# EAGLE design LEDPanel (EAGLE 9.4.2)
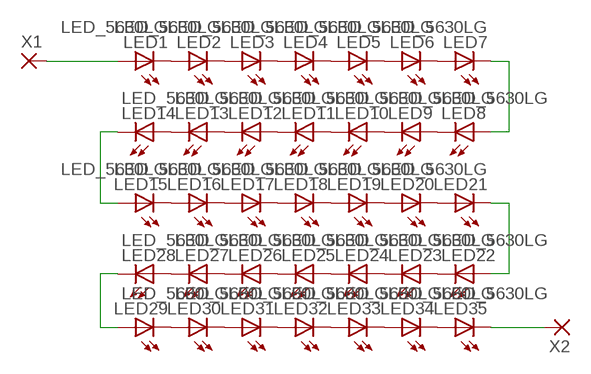
[diagram p0: schematic, sheet 1]

## Parts
LED1  LED_5630LG  [LED5630_LG]
LED2  LED_5630LG  [LED5630_LG]
LED3  LED_5630LG  [LED5630_LG]
LED4  LED_5630LG  [LED5630_LG]
LED5  LED_5630LG  [LED5630_LG]
LED6  LED_5630LG  [LED5630_LG]
LED7  LED_5630LG  [LED5630_LG]
LED8  LED_5630LG  [LED5630_LG]
LED9  LED_5630LG  [LED5630_LG]
LED10  LED_5630LG  [LED5630_LG]
LED11  LED_5630LG  [LED5630_LG]
LED12  LED_5630LG  [LED5630_LG]
LED13  LED_5630LG  [LED5630_LG]
LED14  LED_5630LG  [LED5630_LG]
LED15  LED_5630LG  [LED5630_LG]
LED16  LED_5630LG  [LED5630_LG]
LED17  LED_5630LG  [LED5630_LG]
LED18  LED_5630LG  [LED5630_LG]
LED19  LED_5630LG  [LED5630_LG]
LED20  LED_5630LG  [LED5630_LG]
LED21  LED_5630LG  [LED5630_LG]
LED22  LED_5630LG  [LED5630_LG]
LED23  LED_5630LG  [LED5630_LG]
LED24  LED_5630LG  [LED5630_LG]
LED25  LED_5630LG  [LED5630_LG]
LED26  LED_5630LG  [LED5630_LG]
LED27  LED_5630LG  [LED5630_LG]
LED28  LED_5630LG  [LED5630_LG]
LED29  LED_5630LG  [LED5630_LG]
LED30  LED_5630LG  [LED5630_LG]
LED31  LED_5630LG  [LED5630_LG]
LED32  LED_5630LG  [LED5630_LG]
LED33  LED_5630LG  [LED5630_LG]
LED34  LED_5630LG  [LED5630_LG]
LED35  LED_5630LG  [LED5630_LG]
X1  WIREPAD-SMD2  [PAD-1.27X2.54]
X2  WIREPAD-SMD2  [PAD-1.27X2.54]

## Nets
1: LED1.A1(A) LED1.A2(A) LED1.A-TAB(A) X1.P$1(P)
2: LED1.C1(C) LED1.C-NC(C) LED2.A1(A) LED2.A2(A) LED2.A-TAB(A)
3: LED2.C1(C) LED2.C-NC(C) LED3.A1(A) LED3.A2(A) LED3.A-TAB(A)
4: LED3.C1(C) LED3.C-NC(C) LED4.A1(A) LED4.A2(A) LED4.A-TAB(A)
5: LED4.C1(C) LED4.C-NC(C) LED5.A1(A) LED5.A2(A) LED5.A-TAB(A)
6: LED5.C1(C) LED5.C-NC(C) LED6.A1(A) LED6.A2(A) LED6.A-TAB(A)
7: LED6.C1(C) LED6.C-NC(C) LED7.A1(A) LED7.A2(A) LED7.A-TAB(A)
8: LED7.C1(C) LED7.C-NC(C) LED8.A1(A) LED8.A2(A) LED8.A-TAB(A)
9: LED8.C1(C) LED8.C-NC(C) LED9.A1(A) LED9.A2(A) LED9.A-TAB(A)
10: LED9.C1(C) LED9.C-NC(C) LED10.A1(A) LED10.A2(A) LED10.A-TAB(A)
11: LED10.C1(C) LED10.C-NC(C) LED11.A1(A) LED11.A2(A) LED11.A-TAB(A)
12: LED11.C1(C) LED11.C-NC(C) LED12.A1(A) LED12.A2(A) LED12.A-TAB(A)
13: LED12.C1(C) LED12.C-NC(C) LED13.A1(A) LED13.A2(A) LED13.A-TAB(A)
14: LED13.C1(C) LED13.C-NC(C) LED14.A1(A) LED14.A2(A) LED14.A-TAB(A)
15: LED14.C1(C) LED14.C-NC(C) LED15.A1(A) LED15.A2(A) LED15.A-TAB(A)
16: LED15.C1(C) LED15.C-NC(C) LED16.A1(A) LED16.A2(A) LED16.A-TAB(A)
17: LED16.C1(C) LED16.C-NC(C) LED17.A1(A) LED17.A2(A) LED17.A-TAB(A)
18: LED17.C1(C) LED17.C-NC(C) LED18.A1(A) LED18.A2(A) LED18.A-TAB(A)
19: LED18.C1(C) LED18.C-NC(C) LED19.A1(A) LED19.A2(A) LED19.A-TAB(A)
20: LED19.C1(C) LED19.C-NC(C) LED20.A1(A) LED20.A2(A) LED20.A-TAB(A)
21: LED20.C1(C) LED20.C-NC(C) LED21.A1(A) LED21.A2(A) LED21.A-TAB(A)
22: LED21.C1(C) LED21.C-NC(C) LED22.A1(A) LED22.A2(A) LED22.A-TAB(A)
23: LED22.C1(C) LED22.C-NC(C) LED23.A1(A) LED23.A2(A) LED23.A-TAB(A)
24: LED23.C1(C) LED23.C-NC(C) LED24.A1(A) LED24.A2(A) LED24.A-TAB(A)
25: LED24.C1(C) LED24.C-NC(C) LED25.A1(A) LED25.A2(A) LED25.A-TAB(A)
26: LED25.C1(C) LED25.C-NC(C) LED26.A1(A) LED26.A2(A) LED26.A-TAB(A)
27: LED26.C1(C) LED26.C-NC(C) LED27.A1(A) LED27.A2(A) LED27.A-TAB(A)
28: LED27.C1(C) LED27.C-NC(C) LED28.A1(A) LED28.A2(A) LED28.A-TAB(A)
29: LED28.C1(C) LED28.C-NC(C) LED29.A1(A) LED29.A2(A) LED29.A-TAB(A)
30: LED29.C1(C) LED29.C-NC(C) LED30.A1(A) LED30.A2(A) LED30.A-TAB(A)
31: LED30.C1(C) LED30.C-NC(C) LED31.A1(A) LED31.A2(A) LED31.A-TAB(A)
32: LED31.C1(C) LED31.C-NC(C) LED32.A1(A) LED32.A2(A) LED32.A-TAB(A)
33: LED32.C1(C) LED32.C-NC(C) LED33.A1(A) LED33.A2(A) LED33.A-TAB(A)
34: LED33.C1(C) LED33.C-NC(C) LED34.A1(A) LED34.A2(A) LED34.A-TAB(A)
35: LED34.C1(C) LED34.C-NC(C) LED35.A1(A) LED35.A2(A) LED35.A-TAB(A)
36: LED35.C1(C) LED35.C-NC(C) X2.P$1(P)

## Library data of the parts
LED1-LED35 = Flamberm:LED_
X1 X2 = Flamberm:WIREPAD-SMD2: SMD PAD

## Board
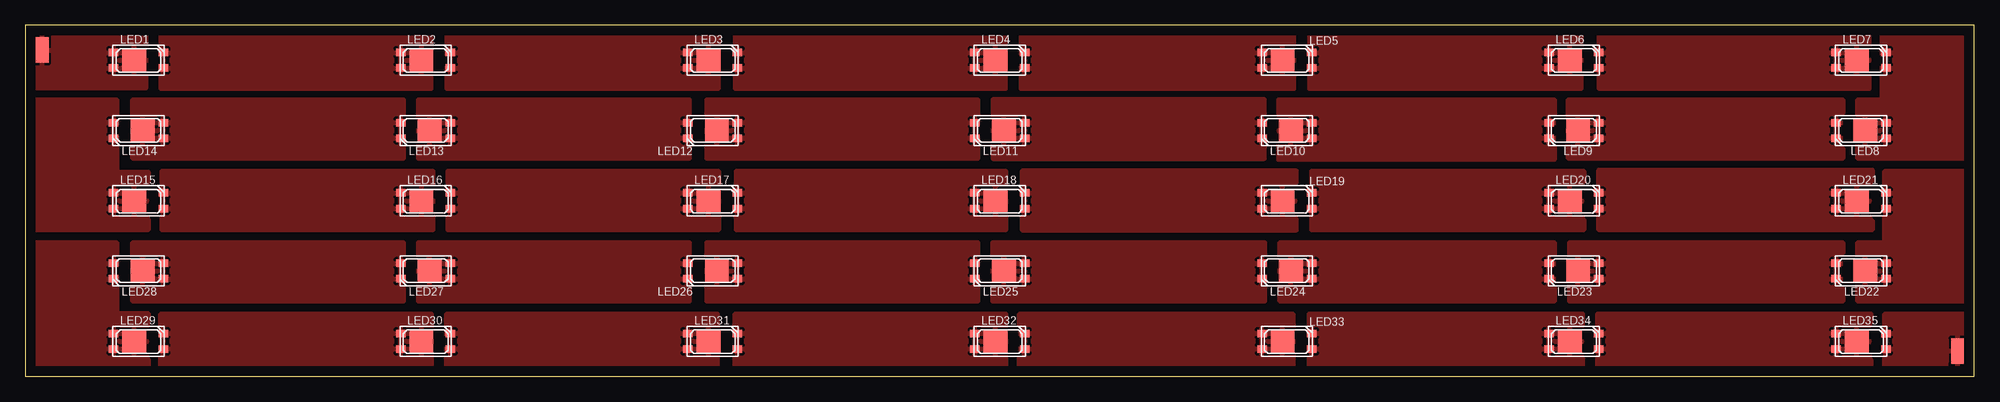
[diagram p1: board, top side]

Size 194 x 35 mm. Coordinates in mm from the lower left corner, seen from the top.
Outline: 0,0 194,0 194,35 0,35 0,0
Copper layers (1*16): Top 0.035mm / dielectric 1.5mm / Bottom 0.035mm
Design rules "default": minimum track width 6mil, minimum drill 0.35mm, track to track 6mil, track to pad 6mil, pad to pad 6mil, via to via 6mil, smd to smd 6mil, copper to edge 40mil, drill to drill 6mil, minimum pad ring 10mil, minimum via ring 8mil, stop-mask expansion 4mil, vias tented up to drill 0mil, thermal gap 10mil

### Footprints (pad centres in the part's own frame; a part is rotated, then mirrored left to right if it is on the bottom)
LED5630_LG = smd 0.95 x 0.75: A1 -2.475,-0.775; A2 -2.475,0.775; C1 2.475,-0.775; C-NC 2.475,0.775 | smd 2.37 x 2.2: A-TAB -0.415,0
PAD-1.27X2.54 = smd 2.54 x 1.27: P$1 0,0

### Placement (x,y rotation side)
LED1  11.29,31.5 0 top
LED2  39.86,31.5 0 top
LED3  68.43,31.5 0 top
LED4  97,31.5 0 top
LED5  125.57,31.5 0 top
LED6  154.14,31.5 0 top
LED7  182.71,31.5 0 top
LED8  182.71,24.5 180 top
LED9  154.14,24.5 180 top
LED10  125.57,24.5 180 top
LED11  97,24.5 180 top
LED12  68.43,24.5 180 top
LED13  39.86,24.5 180 top
LED14  11.29,24.5 180 top
LED15  11.29,17.5 0 top
LED16  39.86,17.5 0 top
LED17  68.43,17.5 0 top
LED18  97,17.5 0 top
LED19  125.57,17.5 0 top
LED20  154.14,17.5 0 top
LED21  182.71,17.5 0 top
LED22  182.71,10.5 180 top
LED23  154.14,10.5 180 top
LED24  125.57,10.5 180 top
LED25  97,10.5 180 top
LED26  68.43,10.5 180 top
LED27  39.86,10.5 180 top
LED28  11.29,10.5 180 top
LED29  11.29,3.5 0 top
LED30  39.86,3.5 0 top
LED31  68.43,3.5 0 top
LED32  97,3.5 0 top
LED33  125.57,3.5 0 top
LED34  154.14,3.5 0 top
LED35  182.71,3.5 0 top
X1  1.7,32.51 90 top
X2  192.33,2.54 90 top

### Tracks (layer width: path | path; a pad name or v marks a point on that pad's centre or on a via)
1
  pour Top (isolate 1.016): -3,34.92 11.99,34.92 11.99,28.7 -3,28.7
2
  pour Top (isolate 1.016): 13.51,34.92 13.51,28.7 40.43,28.7 40.43,34.92
3
  pour Top (isolate 1.016): 41.96,34.92 41.96,28.7 69.01,28.7 69.01,34.92
4
  pour Top (isolate 1.016): 70.66,34.92 70.66,28.7 97.58,28.7 97.58,34.92
5
  pour Top (isolate 1.016): 99.11,34.92 99.11,28.7 126.29,28.7 126.29,34.92
6
  pour Top (isolate 1.016): 127.81,34.92 127.81,28.7 154.86,28.7 154.86,34.92
7
  pour Top (isolate 1.016): 156.64,34.92 156.64,28.7 183.56,28.7 183.56,34.92
8
  pour Top (isolate 1.016): 182.42,21.72 182.42,27.56 184.83,27.56 184.83,36.2 197.66,36.2 197.66,21.72
9
  pour Top (isolate 1.016): 153.59,27.56 180.9,27.56 180.9,21.72 153.59,21.72
10
  pour Top (isolate 1.016): 124.76,27.56 152.19,27.56 152.19,21.59 124.76,21.59
11
  pour Top (isolate 1.016): 123.36,27.56 96.31,27.56 96.31,21.72 123.36,21.72
12
  pour Top (isolate 1.016): 67.87,27.56 94.79,27.56 94.79,21.72 67.87,21.72
13
  pour Top (isolate 1.016): 39.16,27.56 66.09,27.56 66.09,21.72 39.16,21.72
14
  pour Top (isolate 1.016): 10.72,27.56 37.64,27.56 37.64,21.72 10.72,21.72
15
  pour Top (isolate 1.016): -3,27.56 9.11,27.56 9.11,20.36 12.24,20.36 12.24,14.61 -3,14.61
16
  pour Top (isolate 1.016): 13.64,20.45 40.56,20.45 40.56,14.61 13.64,14.61
17
  pour Top (isolate 1.016): 42.09,20.45 69.01,20.45 69.01,14.61 42.09,14.61
18
  pour Top (isolate 1.016): 70.79,20.45 97.58,20.45 97.58,14.61 70.79,14.61
19
  pour Top (isolate 1.016): 126.54,20.45 99.23,20.45 99.23,14.61 126.54,14.61
20
  pour Top (isolate 1.016): 128.06,20.45 155.12,20.45 155.12,14.61 128.06,14.61
21
  pour Top (isolate 1.016): 156.64,20.57 183.82,20.57 183.82,14.61 156.64,14.61
22
  pour Top (isolate 1.016): 182.42,7.49 182.42,13.34 185.09,13.34 185.09,20.45 197.66,20.45 197.66,7.49
23
  pour Top (isolate 1.016): 153.72,13.34 180.9,13.34 180.9,7.49 153.72,7.49
24
  pour Top (isolate 1.016): 124.89,13.34 152.19,13.34 152.19,7.49 124.89,7.49
25
  pour Top (isolate 1.016): 96.31,13.34 123.36,13.34 123.36,7.49 96.31,7.49
26
  pour Top (isolate 1.016): 67.87,13.34 94.79,13.34 94.79,7.49 67.87,7.49
27
  pour Top (isolate 1.016): 39.16,13.34 66.09,13.34 66.09,7.49 39.16,7.49
28
  pour Top (isolate 1.016): 10.72,13.34 37.64,13.34 37.64,7.49 10.72,7.49
29
  pour Top (isolate 1.016): -3,13.34 9.11,13.34 9.11,6.27 12.24,6.27 12.24,0 -3,0
30
  pour Top (isolate 1.016): 13.51,6.22 40.43,6.22 40.43,0 13.51,0
31
  pour Top (isolate 1.016): 41.96,6.22 68.88,6.22 68.88,-0.76 41.96,-0.76
32
  pour Top (isolate 1.016): 70.66,6.22 97.58,6.22 97.58,-0.76 70.66,-0.76
33
  pour Top (isolate 1.016): 98.98,6.22 126.16,6.22 126.16,-0.89 98.98,-0.76
34
  pour Top (isolate 1.016): 127.81,6.22 154.99,6.22 154.99,-0.89 127.81,-0.89
35
  pour Top (isolate 1.016): 156.51,6.22 183.69,6.22 183.69,-0.76 156.51,-0.76
36
  pour Top (isolate 1.016): 185.09,6.22 197.66,6.22 197.66,-0.64 185.09,-0.64